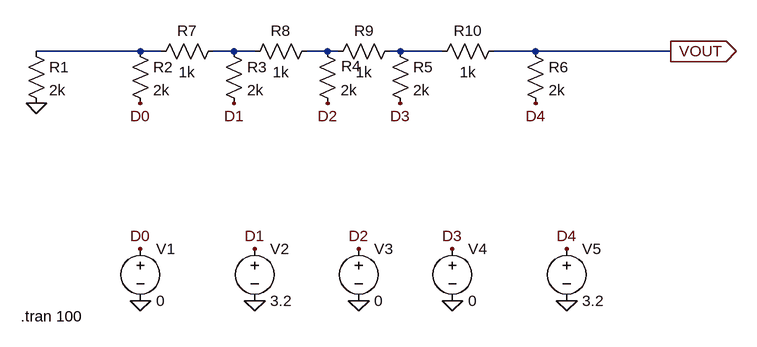
[diagram p0: schematic DAC.asc]
DAC.asc, the LTspice schematic file:
Version 4.1
SHEET 1 1424 680
WIRE 288 112 128 112
WIRE 320 112 288 112
WIRE 432 112 400 112
WIRE 464 112 432 112
WIRE 576 112 544 112
WIRE 592 112 576 112
WIRE 688 112 672 112
WIRE 752 112 688 112
WIRE 896 112 832 112
WIRE 1104 112 896 112
FLAG 128 192 0
FLAG 288 192 D0
FLAG 432 192 D1
FLAG 576 192 D2
FLAG 688 192 D3
FLAG 896 192 D4
FLAG 288 496 0
FLAG 464 496 0
FLAG 624 496 0
FLAG 768 496 0
FLAG 944 496 0
FLAG 288 416 D0
FLAG 464 416 D1
FLAG 624 416 D2
FLAG 768 416 D3
FLAG 944 416 D4
FLAG 1104 112 VOUT
IOPIN 1104 112 Out
SYMBOL res 112 96 R0
SYMATTR InstName R1
SYMATTR Value 2k
SYMBOL res 272 96 R0
SYMATTR InstName R2
SYMATTR Value 2k
SYMBOL res 416 96 R0
SYMATTR InstName R3
SYMATTR Value 2k
SYMBOL res 560 96 R0
WINDOW 0 52 54 Bottom 2
SYMATTR InstName R4
SYMATTR Value 2k
SYMBOL res 672 96 R0
SYMATTR InstName R5
SYMATTR Value 2k
SYMBOL res 880 96 R0
SYMATTR InstName R6
SYMATTR Value 2k
SYMBOL res 416 96 R90
WINDOW 0 0 56 VBottom 2
WINDOW 3 32 56 VTop 2
SYMATTR InstName R7
SYMATTR Value 1k
SYMBOL res 560 96 R90
WINDOW 0 0 56 VBottom 2
WINDOW 3 32 56 VTop 2
SYMATTR InstName R8
SYMATTR Value 1k
SYMBOL res 688 96 R90
WINDOW 0 0 56 VBottom 2
WINDOW 3 32 56 VTop 2
SYMATTR InstName R9
SYMATTR Value 1k
SYMBOL res 848 96 R90
WINDOW 0 0 56 VBottom 2
WINDOW 3 32 56 VTop 2
SYMATTR InstName R10
SYMATTR Value 1k
SYMBOL voltage 288 400 R0
WINDOW 123 0 0 Left 0
WINDOW 39 0 0 Left 0
SYMATTR InstName V1
SYMATTR Value 0
SYMBOL voltage 464 400 R0
WINDOW 123 0 0 Left 0
WINDOW 39 0 0 Left 0
SYMATTR InstName V2
SYMATTR Value 3.2
SYMBOL voltage 624 400 R0
WINDOW 123 0 0 Left 0
WINDOW 39 0 0 Left 0
SYMATTR InstName V3
SYMATTR Value 0
SYMBOL voltage 768 400 R0
WINDOW 123 0 0 Left 0
WINDOW 39 0 0 Left 0
SYMATTR InstName V4
SYMATTR Value 0
SYMBOL voltage 944 400 R0
WINDOW 123 0 0 Left 0
WINDOW 39 0 0 Left 0
SYMATTR InstName V5
SYMATTR Value 3.2
TEXT 104 520 Left 2 !.tran 100

The netlist it stands for:
* DAC.asc
R1 N001 0 2k
R2 N001 D0 2k
R3 N002 D1 2k
R4 N003 D2 2k
R5 N004 D3 2k
R6 VOUT D4 2k
R7 N002 N001 1k
R8 N003 N002 1k
R9 N004 N003 1k
R10 VOUT N004 1k
V1 D0 0 0
V2 D1 0 3.2
V3 D2 0 0
V4 D3 0 0
V5 D4 0 3.2
.tran 100
.backanno
.end